# Altium schematic sheet POWER.SchDoc
size A; SheetNumber: 7; SheetTotal: 7
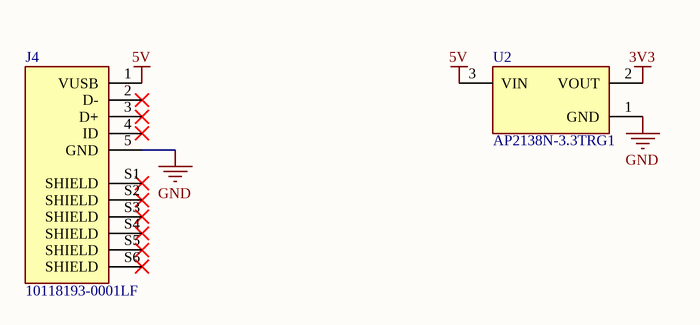
[diagram p0: POWER.SchDoc]

## Parts
J4  10118193-0001LF  [FCI_10118193-0001LF]
U2  AP2138N-3.3TRG1  [FP-SOT23-MFG]

## Nets
3V3: U2.2(VOUT)
5V: J4.1(VUSB) U2.3(VIN)
GND: J4.5(GND) U2.1(GND)

Not connected (* = marked no-connect by the designer): J4 2(D-)* 3(D+)* 4(ID)* S1(SHIELD)* S2(SHIELD)* S3(SHIELD)* S4(SHIELD)* S5(SHIELD)* S6(SHIELD)*

## Library data of the parts
J4 = 10118193-0001LF: USB - micro B USB 2.0 Receptacle Connector 5 Position Surface Mount, Right Angle; Through Hole; MF: Amphenol ICC; Availability: Unavailable; SnapEDA_Link: https://www.snapeda.com/parts/10118193-0001LF/Amphenol%20FCI/view-part/2758989/?ref=snap; MP: 10118193-0001LF; Price: None; Value: *; Package: None
U2 = AP2138N-3.3TRG1: IC REG LINEAR 3.3V 250MA SOT23-3